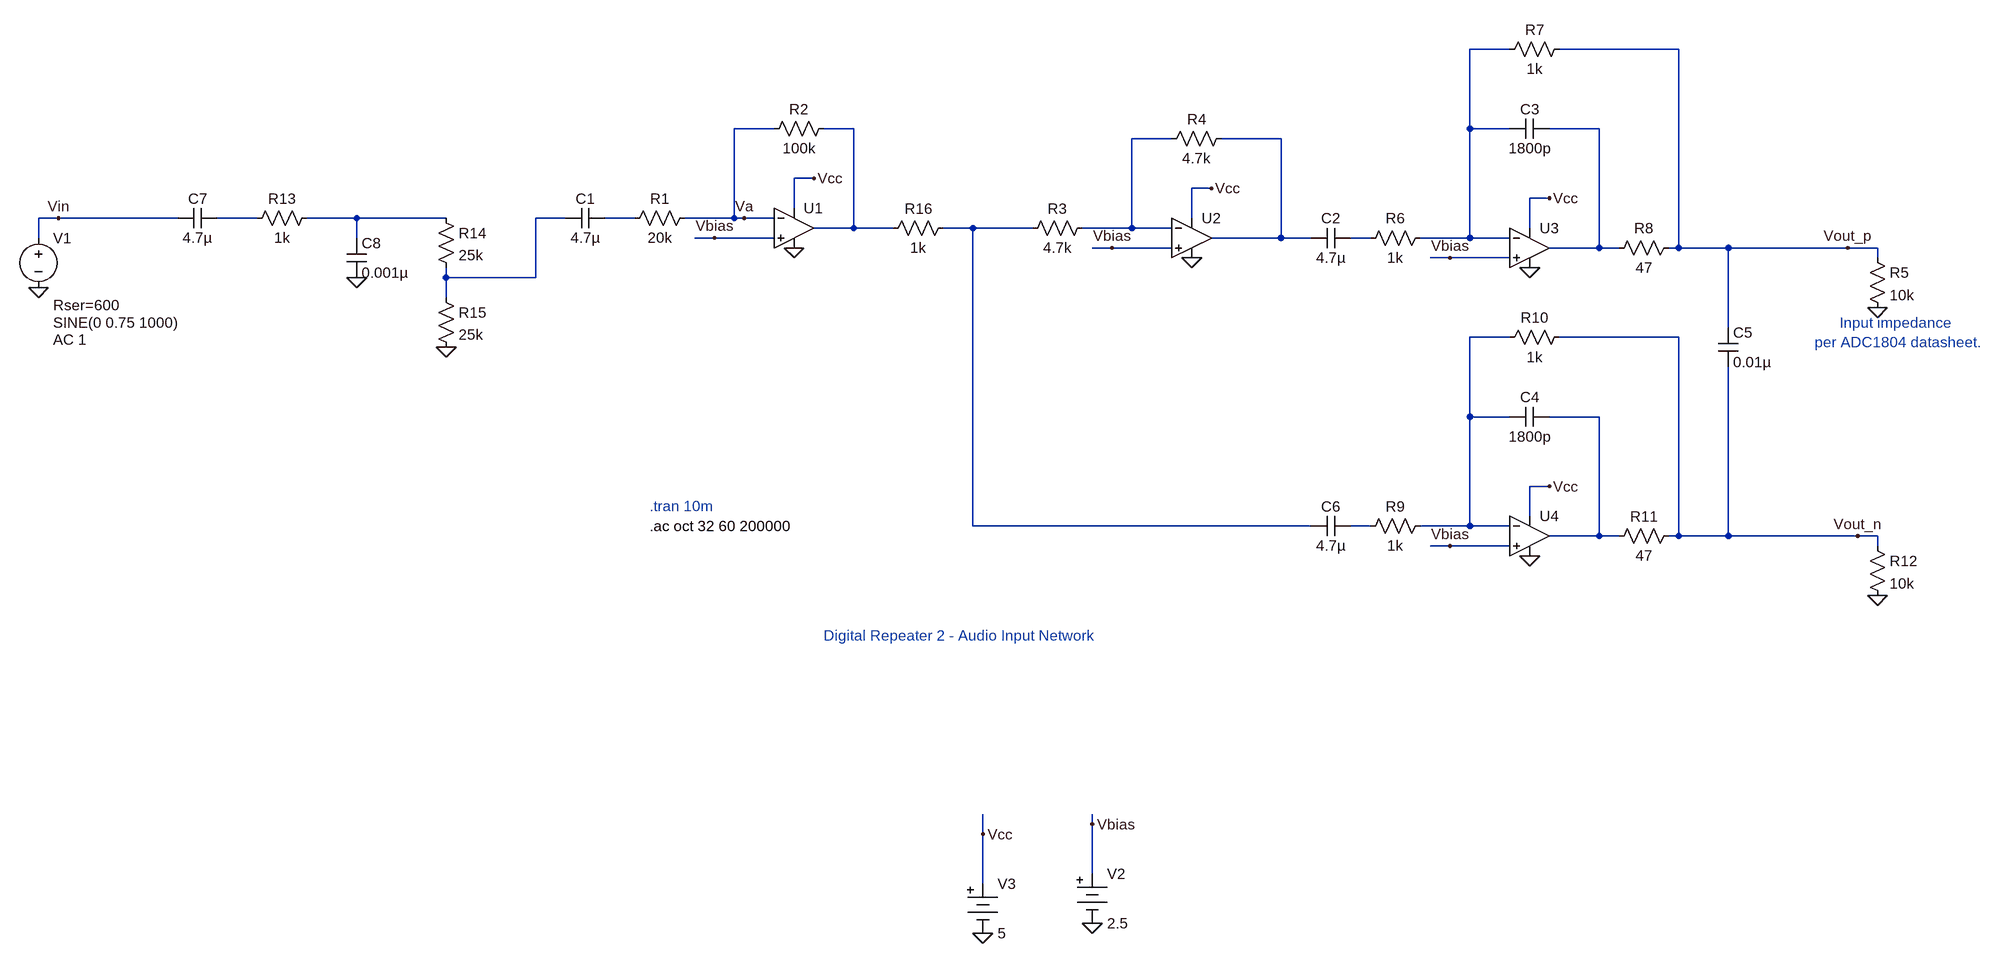
[diagram p0: schematic in1.asc]
in1.asc, the LTspice schematic file:
Version 4
SHEET 1 2384 1288
WIRE 1312 -160 1248 -160
WIRE 1584 -160 1392 -160
WIRE 128 -32 64 -32
WIRE 256 -32 208 -32
WIRE 1248 -32 1248 -160
WIRE 1312 -32 1248 -32
WIRE 1456 -32 1376 -32
WIRE 768 -16 704 -16
WIRE 944 -16 848 -16
WIRE 192 48 160 48
WIRE 832 64 800 64
WIRE 1376 80 1344 80
WIRE 160 96 160 48
WIRE -1024 112 -1056 112
WIRE -832 112 -1024 112
WIRE -704 112 -768 112
WIRE -544 112 -624 112
WIRE -400 112 -544 112
WIRE -208 112 -256 112
WIRE -96 112 -144 112
WIRE 64 112 64 -32
WIRE 64 112 -16 112
WIRE 80 112 64 112
WIRE 128 112 80 112
WIRE 800 112 800 64
WIRE 256 128 256 -32
WIRE 256 128 192 128
WIRE 320 128 256 128
WIRE 448 128 400 128
WIRE 544 128 448 128
WIRE 704 128 704 -16
WIRE 704 128 624 128
WIRE 768 128 704 128
WIRE 1344 128 1344 80
WIRE -1056 144 -1056 112
WIRE -544 144 -544 112
WIRE 32 144 0 144
WIRE 128 144 32 144
WIRE 944 144 944 -16
WIRE 944 144 832 144
WIRE 992 144 944 144
WIRE 1088 144 1056 144
WIRE 1248 144 1248 -32
WIRE 1248 144 1168 144
WIRE 1312 144 1248 144
WIRE 672 160 640 160
WIRE 768 160 672 160
WIRE 1456 160 1456 -32
WIRE 1456 160 1376 160
WIRE 1488 160 1456 160
WIRE 1584 160 1584 -160
WIRE 1584 160 1568 160
WIRE 1664 160 1584 160
WIRE 1856 160 1664 160
WIRE 1904 160 1856 160
WIRE 1216 176 1184 176
WIRE 1312 176 1216 176
WIRE 1904 176 1904 160
WIRE -400 208 -400 192
WIRE -256 208 -256 112
WIRE -256 208 -400 208
WIRE -400 240 -400 208
WIRE 1664 288 1664 160
WIRE 1312 304 1248 304
WIRE 1584 304 1392 304
WIRE 1248 432 1248 304
WIRE 1312 432 1248 432
WIRE 1456 432 1376 432
WIRE 1376 544 1344 544
WIRE 1344 592 1344 544
WIRE 448 608 448 128
WIRE 992 608 448 608
WIRE 1088 608 1056 608
WIRE 1248 608 1248 432
WIRE 1248 608 1168 608
WIRE 1312 608 1248 608
WIRE 1456 624 1456 432
WIRE 1456 624 1376 624
WIRE 1488 624 1456 624
WIRE 1584 624 1584 304
WIRE 1584 624 1568 624
WIRE 1664 624 1664 352
WIRE 1664 624 1584 624
WIRE 1872 624 1664 624
WIRE 1904 624 1872 624
WIRE 1216 640 1184 640
WIRE 1312 640 1216 640
WIRE 1904 640 1904 624
WIRE 640 1088 640 1072
WIRE 464 1104 464 1072
WIRE 640 1168 640 1088
WIRE 464 1184 464 1104
FLAG 640 1248 0
FLAG -1056 224 0
FLAG 1904 256 0
FLAG 160 160 0
FLAG 464 1264 0
FLAG 1856 160 Vout_p
FLAG -1024 112 Vin
FLAG 32 144 Vbias
FLAG 640 1088 Vbias
FLAG 464 1104 Vcc
FLAG 192 48 Vcc
FLAG 800 176 0
FLAG 672 160 Vbias
FLAG 832 64 Vcc
FLAG 1344 192 0
FLAG 1216 176 Vbias
FLAG 1376 80 Vcc
FLAG 1344 656 0
FLAG 1216 640 Vbias
FLAG 1376 544 Vcc
FLAG 1904 720 0
FLAG 1872 624 Vout_n
FLAG -544 208 0
FLAG -400 320 0
FLAG 80 112 Va
SYMBOL voltage -1056 128 R0
WINDOW 3 24 152 Left 2
WINDOW 123 24 180 Left 2
WINDOW 39 24 124 Left 2
SYMATTR Value SINE(0 0.75 1000)
SYMATTR Value2 AC 1
SYMATTR SpiceLine Rser=600
SYMATTR InstName V1
SYMBOL Misc\\battery 640 1152 R0
WINDOW 123 0 0 Left 0
WINDOW 39 0 0 Left 0
SYMATTR InstName V2
SYMATTR Value 2.5
SYMBOL res 0 96 R90
WINDOW 0 0 56 VBottom 2
WINDOW 3 32 56 VTop 2
SYMATTR InstName R1
SYMATTR Value 20k
SYMBOL res 224 -48 R90
WINDOW 0 0 56 VBottom 2
WINDOW 3 32 56 VTop 2
SYMATTR InstName R2
SYMATTR Value 100k
SYMBOL res 1888 160 R0
SYMATTR InstName R5
SYMATTR Value 10k
SYMBOL Misc\\battery 464 1168 R0
WINDOW 123 0 0 Left 0
WINDOW 39 0 0 Left 0
SYMATTR InstName V3
SYMATTR Value 5
SYMBOL OpAmps\\UniversalOpAmp 160 128 R0
SYMATTR InstName U1
SYMBOL res 640 112 R90
WINDOW 0 0 56 VBottom 2
WINDOW 3 32 56 VTop 2
SYMATTR InstName R3
SYMATTR Value 4.7k
SYMBOL res 864 -32 R90
WINDOW 0 0 56 VBottom 2
WINDOW 3 32 56 VTop 2
SYMATTR InstName R4
SYMATTR Value 4.7k
SYMBOL OpAmps\\UniversalOpAmp 800 144 R0
SYMATTR InstName U2
SYMBOL res 1184 128 R90
WINDOW 0 0 56 VBottom 2
WINDOW 3 32 56 VTop 2
SYMATTR InstName R6
SYMATTR Value 1k
SYMBOL res 1408 -176 R90
WINDOW 0 0 56 VBottom 2
WINDOW 3 32 56 VTop 2
SYMATTR InstName R7
SYMATTR Value 1k
SYMBOL OpAmps\\UniversalOpAmp 1344 160 R0
SYMATTR InstName U3
SYMBOL cap 1056 128 R90
WINDOW 0 0 32 VBottom 2
WINDOW 3 32 32 VTop 2
SYMATTR InstName C2
SYMATTR Value 4.7µ
SYMBOL res 1584 144 R90
WINDOW 0 0 56 VBottom 2
WINDOW 3 32 56 VTop 2
SYMATTR InstName R8
SYMATTR Value 47
SYMBOL cap 1376 -48 R90
WINDOW 0 0 32 VBottom 2
WINDOW 3 32 32 VTop 2
SYMATTR InstName C3
SYMATTR Value 1800p
SYMBOL res 1184 592 R90
WINDOW 0 0 56 VBottom 2
WINDOW 3 32 56 VTop 2
SYMATTR InstName R9
SYMATTR Value 1k
SYMBOL res 1408 288 R90
WINDOW 0 0 56 VBottom 2
WINDOW 3 32 56 VTop 2
SYMATTR InstName R10
SYMATTR Value 1k
SYMBOL OpAmps\\UniversalOpAmp 1344 624 R0
SYMATTR InstName U4
SYMBOL res 1584 608 R90
WINDOW 0 0 56 VBottom 2
WINDOW 3 32 56 VTop 2
SYMATTR InstName R11
SYMATTR Value 47
SYMBOL cap 1376 416 R90
WINDOW 0 0 32 VBottom 2
WINDOW 3 32 32 VTop 2
SYMATTR InstName C4
SYMATTR Value 1800p
SYMBOL cap 1648 288 R0
SYMATTR InstName C5
SYMATTR Value 0.01µ
SYMBOL res 1888 624 R0
SYMATTR InstName R12
SYMATTR Value 10k
SYMBOL cap 1056 592 R90
WINDOW 0 0 32 VBottom 2
WINDOW 3 32 32 VTop 2
SYMATTR InstName C6
SYMATTR Value 4.7µ
SYMBOL cap -768 96 R90
WINDOW 0 0 32 VBottom 2
WINDOW 3 32 32 VTop 2
SYMATTR InstName C7
SYMATTR Value 4.7µ
SYMBOL res -608 96 R90
WINDOW 0 0 56 VBottom 2
WINDOW 3 32 56 VTop 2
SYMATTR InstName R13
SYMATTR Value 1k
SYMBOL cap -560 144 R0
SYMATTR InstName C8
SYMATTR Value 0.001µ
SYMBOL res -416 96 R0
SYMATTR InstName R14
SYMATTR Value 25k
SYMBOL res -416 224 R0
SYMATTR InstName R15
SYMATTR Value 25k
SYMBOL res 416 112 R90
WINDOW 0 0 56 VBottom 2
WINDOW 3 32 56 VTop 2
SYMATTR InstName R16
SYMATTR Value 1k
SYMBOL cap -144 96 R90
WINDOW 0 0 32 VBottom 2
WINDOW 3 32 32 VTop 2
SYMATTR InstName C1
SYMATTR Value 4.7µ
TEXT -72 576 Left 2 ;.tran 10m
TEXT -72 608 Left 2 !.ac oct 32 60 200000
TEXT 208 784 Left 2 ;Digital Repeater 2 - Audio Input Network
TEXT 1936 296 Center 2 ;Input impedance \nper ADC1804 datasheet.

The netlist it stands for:
* in1.asc
V1 Vin 0 SINE(0 0.75 1000) AC 1 Rser=600
V2 Vbias 0 2.5
R1 Va N009 20k
R2 N002 Va 100k
R5 Vout_p 0 10k
V3 Vcc 0 5
XU1 Vbias Va Vcc 0 N002 level1 Avol=1Meg GBW=10Meg Vos=0 En=0 Enk=0 In=0 Ink=0 Rin=500Meg  ; pins In+ In- V+ V- OUT
R3 N004 N010 4.7k
R4 N005 N004 4.7k
XU2 Vbias N004 Vcc 0 N005 level1 Avol=1Meg GBW=10Meg Vos=0 En=0 Enk=0 In=0 Ink=0 Rin=500Meg  ; pins In+ In- V+ V- OUT
R6 N001 N011 1k
R7 Vout_p N001 1k
XU3 Vbias N001 Vcc 0 N003 level1 Avol=1Meg GBW=10Meg Vos=0 En=0 Enk=0 In=0 Ink=0 Rin=500Meg  ; pins In+ In- V+ V- OUT
C2 N011 N005 4.7µ
R8 Vout_p N003 47
C3 N003 N001 1800p
R9 N012 N014 1k
R10 Vout_n N012 1k
XU4 Vbias N012 Vcc 0 N013 level1 Avol=1Meg GBW=10Meg Vos=0 En=0 Enk=0 In=0 Ink=0 Rin=500Meg  ; pins In+ In- V+ V- OUT
R11 Vout_n N013 47
C4 N013 N012 1800p
C5 Vout_p Vout_n 0.01µ
R12 Vout_n 0 10k
C6 N014 N010 4.7µ
C7 N006 Vin 4.7µ
R13 N007 N006 1k
C8 N007 0 0.001µ
R14 N007 N008 25k
R15 N008 0 25k
R16 N010 N002 1k
C1 N009 N008 4.7µ
* .tran 10m
.ac oct 32 60 200000
* Digital Repeater 2 - Audio Input Network
* Input impedance
* per ADC1804 datasheet.
.lib UniversalOpAmp1.lib
.backanno
.end